# EAGLE schematic ps1 (EAGLE 7.5.0)
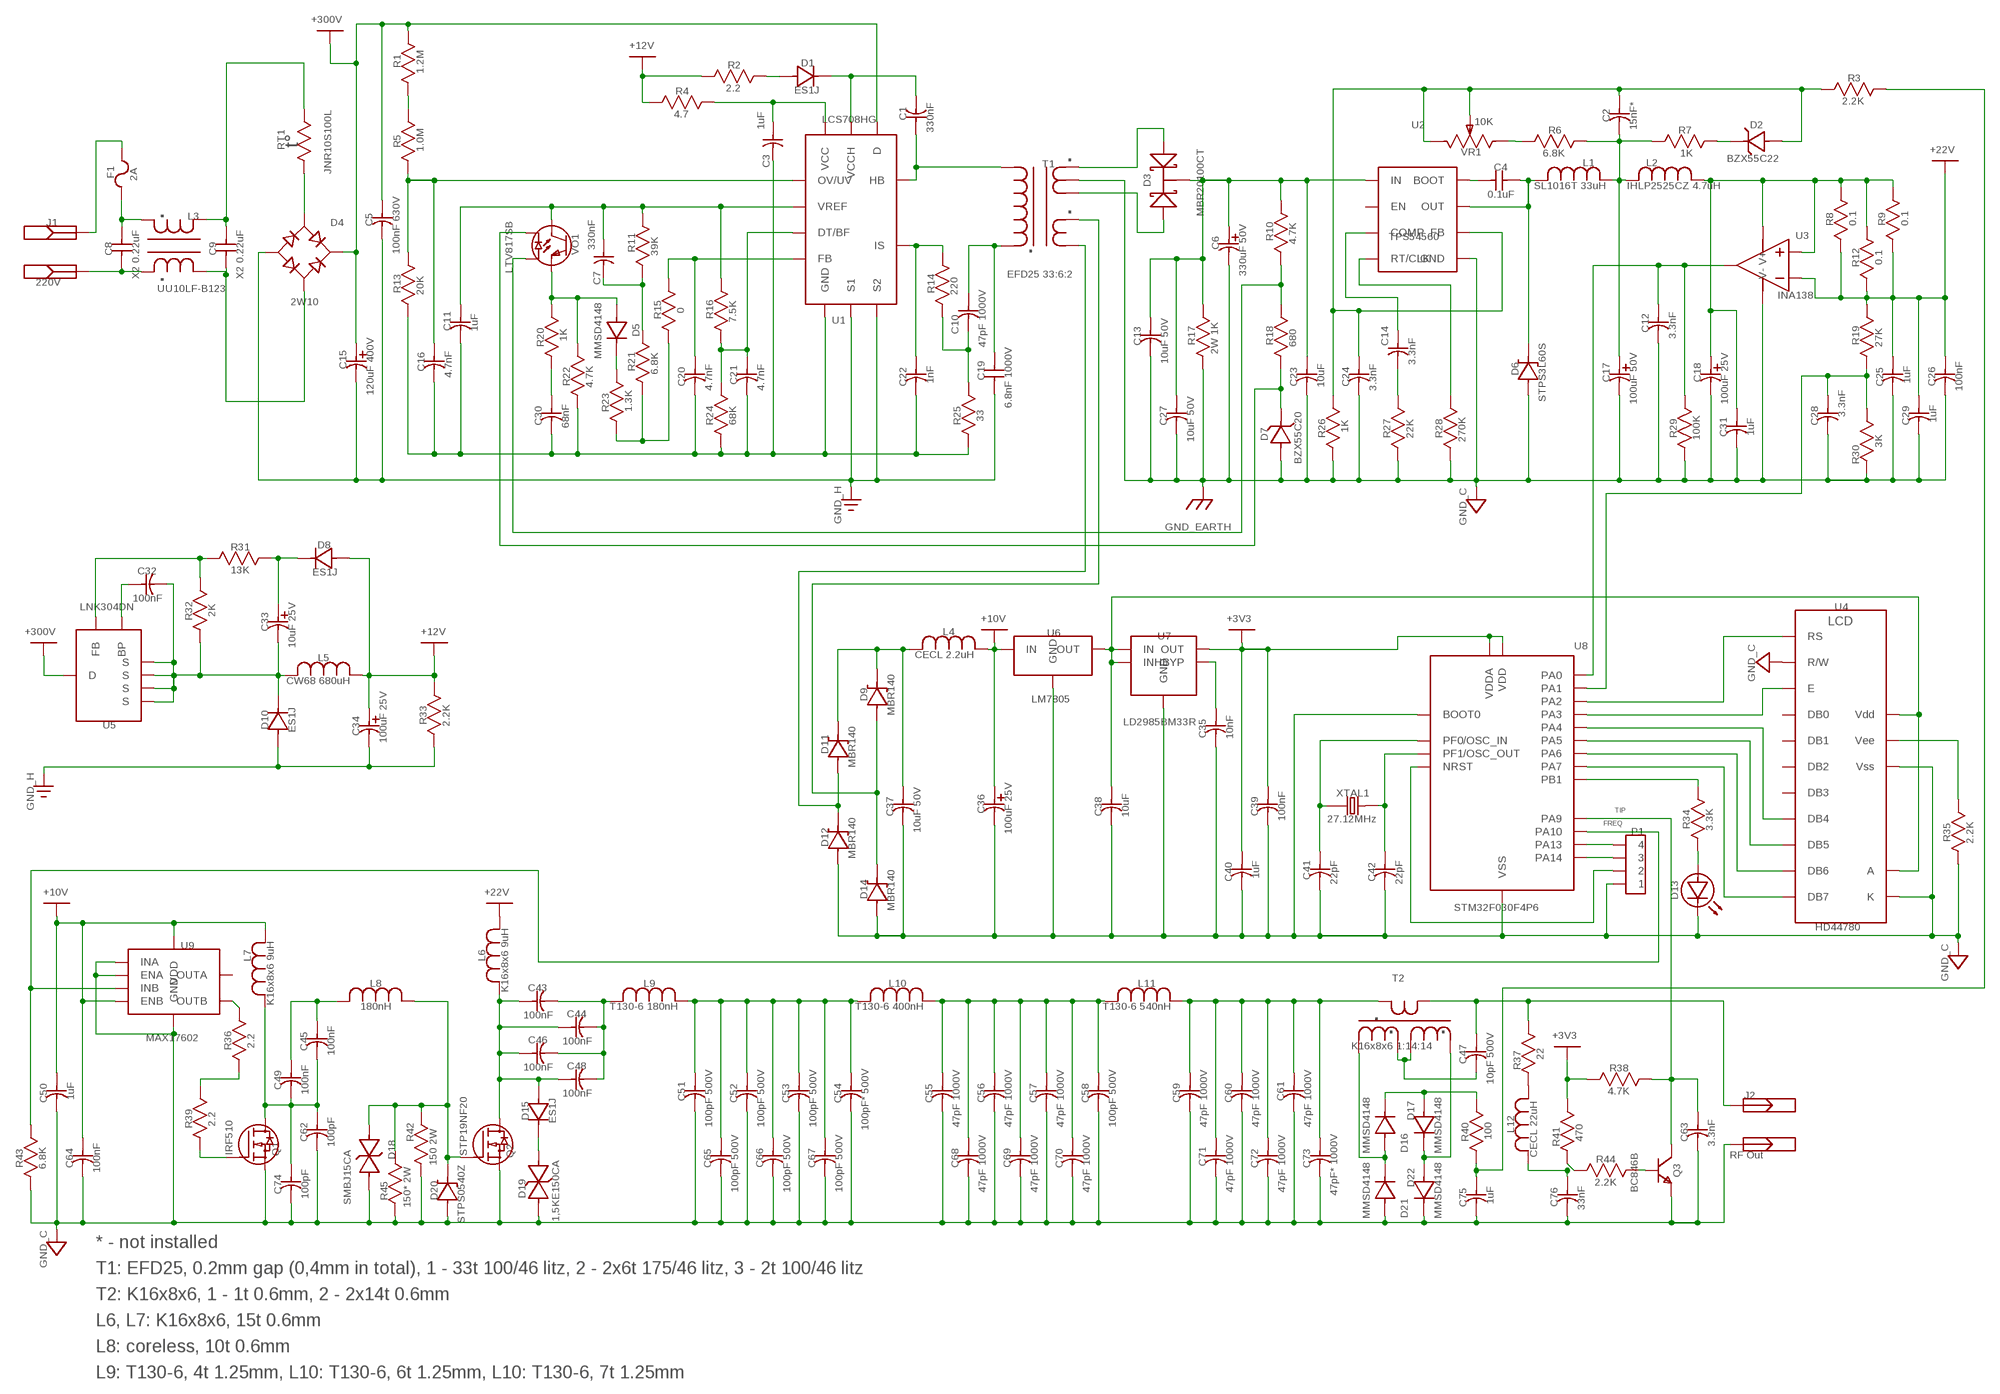
[diagram p0: schematic, sheet 1]

## Parts
C1  330nF  CAP_0805  [CAP_0805]
C2  15nF*  CAP_0805  [CAP_0805]
C3  1uF  CAP_0805  [CAP_0805]
C4  0.1uF  TS17  [TS17]
C5  100nF 630V  CAP_1812  [CAP_1812]
C6  330uF 50V  CAP5X10  [CAP5X10]
C7  330nF  CAP_0805  [CAP_0805]
C8  X2 0.22uF  X2-8  [X2-8]
C9  X2 0.22uF  X2-8  [X2-8]
C10  47pF 1000V  CAP_1206  [CAP_1206]
C11  1uF  CAP_0805  [CAP_0805]
C12  3.3nF  CAP_0805  [CAP_0805]
C13  10uF 50V  CAP_1210  [CAP_1210]
C14  3.3nF  CAP_0805  [CAP_0805]
C15  120uF 400V  CAP7X18  [CAP7X18]
C16  4.7nF  CAP_0805  [CAP_0805]
C17  100uF 50V  CAP5X10  [CAP5X10]
C18  100uF 25V  CAP2.5X6  [CAP2.5X6]
C19  6.8nF 1000V  K78-2  [K78-2]
C20  4.7nF  CAP_0805  [CAP_0805]
C21  4.7nF  CAP_0805  [CAP_0805]
C22  1nF  CAP_0805  [CAP_0805]
C23  10uF  CAP_1210  [CAP_1210]
C24  3.3nF  CAP_0805  [CAP_0805]
C25  1uF  CAP_0805  [CAP_0805]
C26  100nF  CAP_0805  [CAP_0805]
C27  10uF 50V  CAP_1210  [CAP_1210]
C28  3.3nF  CAP_0805  [CAP_0805]
C29  1uF  CAP_0805  [CAP_0805]
C30  68nF  CAP_0805  [CAP_0805]
C31  1uF  CAP_0805  [CAP_0805]
C32  100nF  CAP_0805  [CAP_0805]
C33  10uF 25V  TANT-C  [TANT-C]
C34  100uF 25V  CAP2.5X6  [CAP2.5X6]
C35  10nF  CAP_0805  [CAP_0805]
C36  100uF 25V  CAP2.5X6  [CAP2.5X6]
C37  10uF 50V  CAP_1210  [CAP_1210]
C38  10uF  CAP_0805  [CAP_0805]
C39  100nF  CAP_0805  [CAP_0805]
C40  1uF  CAP_0805  [CAP_0805]
C41  22pF  CAP_0805  [CAP_0805]
C42  22pF  CAP_0805  [CAP_0805]
C43  100nF  CAP_0805  [CAP_0805]
C44  100nF  CAP_0805  [CAP_0805]
C45  100nF  CAP_0805  [CAP_0805]
C46  100nF  CAP_0805  [CAP_0805]
C47  10pF 500V  CAP_1206  [CAP_1206]
C48  100nF  CAP_0805  [CAP_0805]
C49  100nF  CAP_0805  [CAP_0805]
C50  1uF  CAP_0805  [CAP_0805]
C51  100pF 500V  CAP_1206  [CAP_1206]
C52  100pF 500V  CAP_1206  [CAP_1206]
C53  100pF 500V  CAP_1206  [CAP_1206]
C54  100pF* 500V  CAP_1206  [CAP_1206]
C55  47pF 1000V  CAP_1206  [CAP_1206]
C56  47pF 1000V  CAP_1206  [CAP_1206]
C57  47pF 1000V  CAP_1206  [CAP_1206]
C58  100pF 500V  CAP_1206  [CAP_1206]
C59  47pF 1000V  CAP_1206  [CAP_1206]
C60  47pF 1000V  CAP_1206  [CAP_1206]
C61  47pF 1000V  CAP_1206  [CAP_1206]
C62  100pF  CAP_1206  [CAP_1206]
C63  3.3nF  CAP_0805  [CAP_0805]
C64  100nF  CAP_0805  [CAP_0805]
C65  100pF 500V  CAP_1206  [CAP_1206]
C66  100pF 500V  CAP_1206  [CAP_1206]
C67  100pF 500V  CAP_1206  [CAP_1206]
C68  47pF 1000V  CAP_1206  [CAP_1206]
C69  47pF 1000V  CAP_1206  [CAP_1206]
C70  47pF 1000V  CAP_1206  [CAP_1206]
C71  47pF 1000V  CAP_1206  [CAP_1206]
C72  47pF 1000V  CAP_1206  [CAP_1206]
C73  47pF* 1000V  CAP_1206  [CAP_1206]
C74  100pF  CAP_1206  [CAP_1206]
C75  1uF  CAP_0805  [CAP_0805]
C76  33nF  CAP_0805  [CAP_0805]
D1  ES1J  ES1D  [SMA/DO-214AC]
D2  BZX55C22  BZX55C5V6  [DO-35]
D3  MBR20100CT  [TO-220]
D4  2W10  [2W10]
D5  MMSD4148  [SOD-123]
D6  STPS3L60S  [SMC/DO-214AB]
D7  BZX55C20  BZX55C5V6  [DO-35]
D8  ES1J  ES1D  [SMA/DO-214AC]
D9  MBR140  STPS0540Z  [SOD-123]
D10  ES1J  ES1D  [SMA/DO-214AC]
D11  MBR140  STPS0540Z  [SOD-123]
D12  MBR140  STPS0540Z  [SOD-123]
D13  LED_3  [LED3]
D14  MBR140  STPS0540Z  [SOD-123]
D15  ES1J  ES1D  [SMA/DO-214AC]
D16  MMSD4148  [SOD-123]
D17  MMSD4148  [SOD-123]
D18  SMBJ15CA  SM6T200CA  [SMB/DO-214AA]
D19  1,5KE150CA  1,5KE180CA  [DO-201_VERT]
D20  STPS0540Z  [SOD-123]
D21  MMSD4148  [SOD-123]
D22  MMSD4148  [SOD-123]
F1  2A  ZH101A  [ZH101A]
J1  220V  TERM3.8I  [TERM3.8]
J2  RF Out  TERM3.8O  [TERM3.8]
L1  SL1016T 33uH  SL1016T  [SL1016T]
L2  IHLP2525CZ 4.7uH  IHLP2525CZ  [IHLP2525CZ]
L3  UU10LF-B123  [UU10LF-B123]
L4  CECL 2.2uH  CECL-V  [CECL-V]
L5  CW68 680uH  CW68  [CW68]
L6  K16x8x6 9uH  K16X8X6  [K16X8X6]
L7  K16x8x6 9uH  K16X8X6  [K16X8X6]
L8  180nH  CECL-H  [CECL-H]
L9  T130-6 180nH  K32X16X8  [K32X16X8]
L10  T130-6 400nH  K32X16X8  [K32X16X8]
L11  T130-6 540nH  K32X16X8  [K32X16X8]
L12  CECL 22uH  CECL-H  [CECL-H]
P1  PORT4  [JMP4]
Q1  IRF510  STP14NK50Z  [TO-220]
Q2  STP19NF20  STP14NK50Z  [TO-220]
Q3  BC846B  [SOT23]
R1  1.2M  RES_0805  [RES_0805]
R2  2.2  CF-0,25-H  [CF-0,25-H]
R3  2.2K  RES_0805  [RES_0805]
R4  4.7  CF-0,25-H  [CF-0,25-H]
R5  1.0M  CF-0,25-H  [CF-0,25-H]
R6  6.8K  RES_0805  [RES_0805]
R7  1K  RES_0805  [RES_0805]
R8  0.1  RES_1206  [RES_1206]
R9  0.1  RES_1206  [RES_1206]
R10  4.7K  RES_0805  [RES_0805]
R11  39K  RES_0805  [RES_0805]
R12  0.1  RES_1206  [RES_1206]
R13  20K  RES_0805  [RES_0805]
R14  220  RES_0805  [RES_0805]
R15  0  RES_0  [RES_0]
R16  7.5K  RES_0805  [RES_0805]
R17  2W 1K  KNP-2W-V  [KNP-2W-V]
R18  680  RES_0805  [RES_0805]
R19  27K  RES_0805  [RES_0805]
R20  1K  RES_0805  [RES_0805]
R21  6.8K  RES_0805  [RES_0805]
R22  4.7K  RES_0805  [RES_0805]
R23  1.3K  RES_0805  [RES_0805]
R24  68K  RES_0805  [RES_0805]
R25  33  RES_0805  [RES_0805]
R26  1K  RES_0805  [RES_0805]
R27  22K  RES_0805  [RES_0805]
R28  270K  RES_0805  [RES_0805]
R29  100K  RES_0805  [RES_0805]
R30  3K  RES_0805  [RES_0805]
R31  13K  RES_0805  [RES_0805]
R32  2K  RES_0805  [RES_0805]
R33  2.2K  RES_0805  [RES_0805]
R34  3.3K  RES_0805  [RES_0805]
R35  2.2K  RES_0805  [RES_0805]
R36  2.2  RES_0805  [RES_0805]
R37  22  RES_0805  [RES_0805]
R38  4.7K  RES_0805  [RES_0805]
R39  2.2  RES_0805  [RES_0805]
R40  100  RES_0805  [RES_0805]
R41  470  CF-0,25-H  [CF-0,25-H]
R42  150 2W  KNP-2W-V  [KNP-2W-V]
R43  6.8K  RES_0805  [RES_0805]
R44  2.2K  RES_0805  [RES_0805]
R45  150* 2W  KNP-2W-V  [KNP-2W-V]
RT1  JNR10S100L  [JNR10S100L]
T1  EFD25 33:6:2  EFD25  [EFD25]
T2  K16x8x6 1:14:14  K16X8X6-6  [K16X8X6-6]
U1  LCS708HG  [ESIP-16C]
U2  TPS54560  [HSOP]
U3  INA138  [SOT23-5]
U4  HD44780  [HD44780]
U5  LNK304DN  [SOIC-8/150MIL]
U6  LM7805  [TO-220]
U7  LD2985BM33R  LD2985  [SOT23-5L]
U8  STM32F030F4P6  [TSSOP-20]
U9  MAX17602  [SOIC-8/150MIL]
VO1  LTV817SB  [SO-4]
VR1  10K  3362P  [3362P]
XTAL1  27.12MHz  HC-49/U  [HC-49/U]

## Nets
FREQ: R43.1 U8.18(PA10) U9.4(INB)
Net_0: R1.1 R5.2(B)
Net_1: C16.1 R5.1(A) R13.1 U1.5(OV/UV)
Net_2: C3.2 C11.2 C16.2 C20.2 C21.2 C22.2 C30.2 R13.2 R22.1 R24.2 R25.1 U1.4(GND)
Net_3: C7.1 C11.1 R11.2 R16.1 U1.3(VREF) VO1.4(C)
Net_4: C21.1 R16.2 R24.1 U1.7(DT/BF)
Net_5: C5.1 C15.2(PLUS) D4.+ R1.2 U1.16(D) U5.4(D) ; supply symbol labelled +300V
Net_6: C5.2 C15.1(MINUS) C19.1 C34.1(MINUS) D4.- D10.2(A) R33.1 U1.10(S1) U1.11(S2) ; supply symbol labelled GND_H
Net_7: C9.2 L3.4 RT1.2(B)
Net_8: C8.1 J1.2(P1) L3.2
Net_9: C8.2 F1.1 L3.1
Net_10: D5.2(K) R23.1
Net_11: C1.1 T1.1 U1.13(HB)
Net_12: C1.2 D1.1(K) U1.14(VCCH)
Net_13: D1.2(A) R2.2(B)
Net_14: C34.2(PLUS) D8.2(A) L5.2(B) R2.1(A) R4.1(A) R33.2 ; supply symbol labelled +12V
Net_15: C22.1 R14.1 U1.8(IS)
Net_16: C10.1 C19.2 T1.5
Net_17: R15.1 R21.2 R23.2
Net_18: D5.1(A) R20.2 R22.2 VO1.3(E)
Net_19: C7.2 R11.1 R21.1
Net_20: C32.1 U5.1(BP)
Net_21: C32.2 C33.2(MINUS) D10.1(K) L5.1(A) R32.1 U5.5(S) U5.6(S) U5.7(S) U5.8(S)
Net_22: R31.2 R32.2 U5.2(FB)
Net_23: C6.2(PLUS) C13.1 C23.1 C27.1 D3.2(K) R10.2 R17.2 U2.2(IN)
Net_24: C18.2(PLUS) C31.1 L2.2(B) R8.1 R9.1 R12.1 U3.3(IN+) U3.5(V+)
Net_25: C41.1 U8.2(PF0/OSC_IN) XTAL1.1
Net_26: C9.1 D4.AC1(AC2) L3.3
Net_27: C43.2 C44.2 C46.2 C48.2 L9.1(A)
Net_28: C6.1(MINUS) C12.2 C13.2 C17.1(MINUS) C18.1(MINUS) C23.2 C24.2 C25.2 C26.2 C27.2 C28.2 C29.2 C31.2 C35.2 C36.1(MINUS) C37.2 C38.2 C39.2 C40.2 C41.2 C42.2 C50.2 C51.2 C52.2 C53.2 C54.2 C55.2 C56.2 C57.2 C58.2 C59.2 C60.2 C61.2 C62.2 C63.2 C64.2 C65.2 C66.2 C67.2 C68.2 C69.2 C70.2 C71.2 C72.2 C73.2 C74.2 C75.2 C76.2 D6.2(A) D7.2(A) D12.1(A) D13.1(K) D14.1(A) D18.2 D19.2 D20.1(A) D21.1(A) D22.2(K) J2.2(P1) P1.1 Q1.3(S) Q2.3(S) Q3.2(E) R17.1 R26.2 R27.2 R28.2 R29.1 R30.1 R35.1 R42.1 R43.2 R45.2 T1.8 U2.7(GND) U2.9(GND) U3.2(V-) U4.1(Vss) U4.5(R/W) U4.16(K) U6.2(GND) U7.2(GND) U8.1(BOOT0) U8.15(VSS) U9.1(ENA) U9.2(INA) U9.3(GND) ; supply symbol labelled GND_C, GND_EARTH
Net_29: C43.1 C44.1 C46.1 C48.1 D15.2(A) L6.1(A) Q2.2(D)
Net_30: C12.1 R29.2 U3.1(OUT) U8.6(PA0)
Net_31: D7.1(K) R18.1 VO1.2(K)
Net_32: R10.1 R18.2 VO1.1(A)
Net_33: C33.1(PLUS) D8.1(K) R31.1
Net_34: D3.3(A2) T1.6
Net_35: D3.1(A1) T1.10
Net_36: D15.1(K) D19.1
Net_37: C37.1 D9.2(K) D11.2(K) L4.A
Net_38: C42.1 U8.3(PF1/OSC_OUT) XTAL1.2
Net_39: C10.2 R14.2 R25.2
Net_40: C3.1 R4.2(B) U1.1(VCC)
Net_41: P1.2 U8.4(NRST)
Net_42: P1.3 U8.20(PA14)
Net_43: P1.4 U8.19(PA13)
Net_44: C39.1 C40.1 R38.1 R41.1(A) U7.5(OUT) U8.5(VDDA) U8.16(VDD) ; supply symbol labelled +3V3
Net_45: C38.1 U4.2(Vdd) U4.15(A) U6.3(OUT) U7.1(IN) U7.3(INH)
Net_46: C35.1 U7.4(BYP)
Net_47: U4.14(DB7) U8.13(PA7)
Net_48: U4.13(DB6) U8.12(PA6)
Net_49: U4.12(DB5) U8.11(PA5)
Net_50: U4.11(DB4) U8.10(PA4)
Net_51: U4.6(E) U8.9(PA3)
Net_52: U4.4(RS) U8.8(PA2)
Net_53: C51.1 C52.1 C53.1 C54.1 C65.1 C66.1 C67.1 L9.2(B) L10.1(A)
Net_54: C28.1 R19.1 R30.2 U8.7(PA1)
Net_55: R35.2 U4.3(Vee)
Net_56: C4.1 U2.1(BOOT)
Net_57: C4.2 D6.1(K) L1.1(A) U2.8(OUT)
Net_58: C36.2(PLUS) C50.1 C64.1 L4.B L7.2(B) U6.1(IN) U9.6(VDD) U9.8(ENB) ; supply symbol labelled +10V
Net_59: D9.1(A) D14.2(K) T1.9
Net_60: D11.1(A) D12.2(K) T1.7
Net_61: R36.1 U9.5(OUTB)
Net_62: Q1.1(G) R39.2
Net_63: C45.2 C49.2 C62.1 C74.1 L7.1(A) Q1.2(D)
Net_64: C55.1 C56.1 C57.1 C58.1 C68.1 C69.1 C70.1 L10.2(B) L11.1(A)
Net_65: C47.1 J2.1 R37.1 T2.1(A)
Net_66: C25.1 C26.1 C29.1 L6.2(B) R8.2 R9.2 R12.2 R19.2 U3.4(IN-) ; supply symbol labelled +22V
Net_67: D18.1 D20.2(K) L8.B Q2.1(G) R42.2 R45.1
Net_68: Q3.1(B) R44.2
Net_69: D17.2(K) D22.1(A) T2.3(C)
Net_70: C76.1 L12.A R41.2(B) R44.1
Net_71: C2.1 C24.1 D2.2(A) R3.2 R26.1 U2.5(FB) VR1.CW VR1.W
Net_72: D16.1(A) D21.2(K) T2.6(F)
Net_73: D16.2(K) D17.1(A) R40.2
Net_74: L12.B R37.2
Net_75: C45.1 C49.1 L8.A
Net_76: C2.2 C17.2(PLUS) L1.2(B) L2.1(A) R6.1 R7.2
Net_77: R28.1 U2.4(RT/CLK)
Net_78: D4.AC2(AC1) RT1.1(A)
Net_79: C75.1 R3.1 R40.1
Net_80: C47.2 T2.4(D) T2.5(E)
Net_82: C59.1 C60.1 C61.1 C71.1 C72.1 C73.1 L11.2(B) T2.2(B)
Net_83: R6.2 VR1.CCW
Net_84: F1.2 J1.1
Net_85: D13.2(A) R34.1
Net_86: R34.2 U8.14(PB1)
Net_87: R36.2 R39.1
Net_88: D2.1(K) R7.1
Net_90: C20.1 R15.2 U1.6(FB)
Net_91: C14.2 R27.1
Net_92: C14.1 U2.6(COMP)
Net_93: C30.1 R20.1
TIP: C63.1 Q3.3(C) R38.2 U8.17(PA9)
Unconnected: U2.3(EN) U4.7(DB0) U4.8(DB1) U4.9(DB2) U4.10(DB3)

## Notes on the sheet
- +300V
- +12V
- R1 | R2 | D1
- 1.2M
- 2.2 | R3
- ES1J
- R4 | 2.2K
- 4.7
- LCS708HG
- C1 | C2
- 10K
- 1uF | U2 | 15nF* | D2
- 330nF | R6 | R7
- .
- RT1 | t° | R5 | VR1 | 6.8K | 1K
- 1.0M | BZX55C22 | +22V
- C3 | T1 | L1 | L2
- C4
- JNR10S100L
- F1 | 2A
- SL1016T 33uH | IHLP2525CZ 4.7uH
- D3
- 0.1uF
- .
- MBR20100CT
- . | L3
- J1 | D4 | C5 | R8 | 0.1 | R9 | 0.1
- . | TPS54560
- R10 | U3
- 4.7K
- 330nF | R11 | C6
- C8 | C9 | 100nF 630V | VO1 | 39K
- R12 | 0.1
- EFD25 33:6:2
- LTV817SB | 330uF 50V
- 220V | X2 0.22uF | X2 0.22uF
- . | UU10LF-B123 | C7
- R13 | R14 | INA138
- 2W10 | 20K | 220
- 0
- R15 | R16
- 7.5K | U1
- C11 | 1uF | C12
- D5 | C10
- 1K | 3.3nF
- R20 | 47pF 1000V | C13 | R17 | R18 | 680 | C14 | R19 | 27K
- 2W 1K
- MMSD4148
- 10uF 50V | 3.3nF
- C15 | C16 | R21
- 6.8K | D6
- 4.7nF | C19
- C21 | 1nF | C17 | C18 | 1uF
- R22 | 4.7K | C20 | C22 | C23 | 10uF | C24 | C25 | C26
- 4.7nF | 4.7nF | 3.3nF | 100nF
- 120uF 400V
- STPS3L60S | 100uF 50V | 100uF 25V
- 6.8nF 1000V
- R23 | 1.3K
- 3.3nF
- 33 | 1uF
- C30 | R24 | 68K | R25 | C27 | C28 | C29
- 68nF
- 1K
- R26 | R27 | 22K | R28 | R29 | C31 | 1uF
- 10uF 50V | D7 | 270K | 100K
- 3K
- BZX55C20 | R30
- GND_H | GND_C
- GND_EARTH
- R31 | D8
- 13K | ES1J
- C32
- 100nF
- LNK304DN | U4
- 2K | LCD
- R32 | +10V | +3V3
- C33
- +300V | +12V | L4 | U6
- U7
- 10uF 25V | CECL 2.2uH | U8
- L5
- CW68 680uH
- GND_C
- LM7805
- D9
- MBR140 | LD2985BM33R
- U5
- R33 | 2.2K
- D10 | ES1J
- C34 | C35
- 10nF
- 100uF 25V
- D11
- MBR140
- XTAL1
- TIP
- GND_H
- C37 | C36 | C38 | C39 | 27.12MHz
- 10uF
- 100nF | FREQ
- R34 | 3.3K
- 10uF 50V | 100uF 25V | P1
- R35 | 2.2K
- D12
- MBR140
- C40 | 1uF | C41 | C42
- 22pF | 22pF
- +10V | +22V
- D14 | D13
- STM32F030F4P6
- MBR140
- HD44780
- U9
- L7 | L6
- T2 | GND_C
- L8 | L9 | L10 | L11
- K16x8x6 9uH | C43
- 180nH | T130-6 180nH | T130-6 400nH | T130-6 540nH
- K16x8x6 9uH
- 100nF
- C44
- .
- MAX17602 | . | .
- 100nF | +3V3
- C46 | K16x8x6 1:14:14
- R36 | 2.2 | C45
- 100nF
- 22
- 100nF | C47
- C48 | R37 | R38
- 10pF 500V | 4.7K
- C49 | 100nF
- 100nF
- 1uF | C51 | C61 | J2
- C50 | C52 | C53 | C54 | C55 | C56 | C57 | C58 | C59 | C60
- D15 | ES1J | D17
- R39 | 2.2 | 100pF 500V | 100pF 500V | 100pF 500V | 47pF 1000V | 47pF 1000V | 47pF 1000V | 100pF 500V | 47pF 1000V | 47pF 1000V | 47pF 1000V
- 100pF* 500V | L12
- C62 | R42 | R40 | 100 | 470 | C63
- 100pF | R41 | 3.3nF
- MMSD4148 | D16 | MMSD4148 | RF Out
- IRF510 | Q1 | STP19NF20 | Q2 | CECL 22uH
- D18
- 150 2W | R44
- R43 | 6.8K | C64 | C65 | C66 | C67 | C68 | C69 | C70 | C71 | C72 | C73
- 100nF
- 2.2K | Q3
- D22
- C74 | 100pF 500V | 100pF 500V | 100pF 500V | 47pF 1000V | 47pF 1000V | 47pF 1000V | 47pF 1000V | 47pF 1000V | BC846B
- D19 | 47pF* 1000V
- 100pF | R45 | D20
- SMBJ15CA | C75 | 1uF | C76
- 150* 2W | 33nF
- MMSD4148 | D21 | MMSD4148
- STPS0540Z | 1,5KE150CA
- * - not installed
- T1: EFD25, 0.2mm gap (0,4mm in total), 1 - 33t 100/46 litz, 2 - 2x6t 175/46 litz, 3 - 2t 100/46 litz
- GND_C
- T2: K16x8x6, 1 - 1t 0.6mm, 2 - 2x14t 0.6mm
- L6, L7: K16x8x6, 15t 0.6mm
- L8: coreless, 10t 0.6mm
- L9: T130-6, 4t 1.25mm, L10: T130-6, 6t 1.25mm, L10: T130-6, 7t 1.25mm

## Power pins joined to a net without a drawn wire
OUTA: U9.7(OUTA)

## Library data of the parts
C1 C7 = common:CAP_0805
C2 C3 C11 C12 C14 C16 C20-C22 C24-C26 C28-C32 C35 C38-C46 C48-C50 C63 C64 C75 C76 = common:CAP_0805; VALUE: 330nF
C4 = common:TS17
C5 = common:CAP_1812
C6 = common:CAP5X10
C8 C9 = common:X2-8
C10 C55-C57 C59-C61 C68-C72 = common:CAP_1206
C13 C27 C37 = common:CAP_1210
C15 = common:CAP7X18
C17 = common:CAP5X10; VALUE: 330uF 50V
C18 C34 C36 = common:CAP2.5X6
C19 = common:K78-2
C23 = common:CAP_1210; VALUE: 10uF 50V
C33 = common:TANT-C
C47 C51-C54 C58 C62 C65-C67 C73 C74 = common:CAP_1206; VALUE: 47pF 1000V
D1 D8 D10 D15 = common:ES1D
D2 = common:BZX55C5V6
D3 = common:MBR20100CT
D4 = common:2W10
D5 D16 D17 D21 D22 = common:MMSD4148
D6 = common:STPS3L60S
D7 = common:BZX55C5V6; VALUE: BZX55C22
D9 D11 D12 D14 = common:STPS0540Z
D13 = common:LED_3
D18 = common:SM6T200CA
D19 = common:1,5KE180CA
D20 = common:STPS0540Z; VALUE: MBR140
F1 = common:ZH101A
J1 = common:TERM3.8I
J2 = common:TERM3.8O
L1 = common:SL1016T
L2 = common:IHLP2525CZ
L3 = common:UU10LF-B123
L4 = common:CECL-V
L5 = common:CW68
L6 L7 = common:K16X8X6
L8 = common:CECL-H
L9 = common:K32X16X8
L10 L11 = common:K32X16X8; VALUE: T130-6 180nH
L12 = common:CECL-H; VALUE: 180nH
P1 = common:PORT4
Q1 = common:STP14NK50Z
Q2 = common:STP14NK50Z; VALUE: IRF510
Q3 = common:BC846B; DATASHEET: http://datasheets.diptrace.com/philips-nxp/BC846_BC546_SER.pdf; MANUFACTURER: NXP-Philips
R1 = common:RES_0805
R2 = common:CF-0,25-H
R3 R6 R7 R10 R11 R13 R14 R16 R18-R40 R43 R44 = common:RES_0805; VALUE: 1.2M
R4 R5 R41 = common:CF-0,25-H; VALUE: 2.2
R8 R9 R12 = common:RES_1206
R15 = common:RES_0
R17 = common:KNP-2W-V
R42 R45 = common:KNP-2W-V; VALUE: 2W 1K
RT1 = common:JNR10S100L
T1 = common:EFD25
T2 = common:K16X8X6-6
U1 = common:LCS708HG
U2 = common:TPS54560; MANUFACTURER: National Semiconductor
U3 = common:INA138
U4 = common:HD44780
U5 = common:LNK304DN
U6 = common:LM7805; MANUFACTURER: National Semiconductor
U7 = common:LD2985
U8 = common:STM32F030F4P6; MANUFACTURER: ST Microelectronics
U9 = common:MAX17602; MANUFACTURER: Maxim Integrated
VO1 = common:LTV817SB
VR1 = common:3362P
XTAL1 = common:HC-49/U